# EAGLE design 2x16_2MM breakout front (EAGLE 6.3)
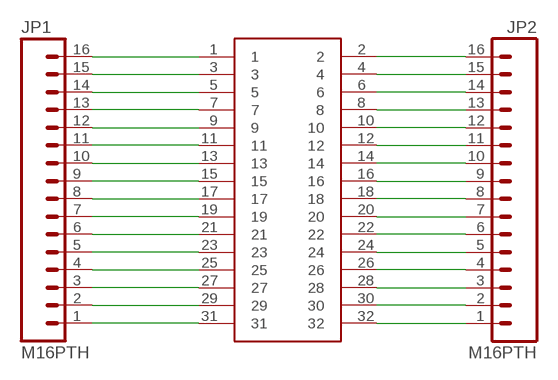
[diagram p0: schematic, sheet 1]

## Parts
JP1  M16PTH  [1X16]
JP2  M16PTH  [1X16]
U$1  2X16_2MM_SMD  [2X16_2MM_SMD]

## Nets
N$1: JP1.16 U$1.1
N$2: JP1.15 U$1.3
N$3: JP1.14 U$1.5
N$4: JP1.13 U$1.7
N$5: JP1.12 U$1.9
N$6: JP1.11 U$1.11
N$7: JP1.10 U$1.13
N$8: JP1.9 U$1.15
N$9: JP1.8 U$1.17
N$10: JP1.7 U$1.19
N$11: JP1.6 U$1.21
N$12: JP1.5 U$1.23
N$13: JP1.4 U$1.25
N$14: JP1.3 U$1.27
N$15: JP1.2 U$1.29
N$16: JP1.1 U$1.31
N$17: JP2.1 U$1.32
N$18: JP2.2 U$1.30
N$19: JP2.3 U$1.28
N$20: JP2.4 U$1.26
N$21: JP2.5 U$1.24
N$22: JP2.6 U$1.22
N$23: JP2.7 U$1.20
N$24: JP2.8 U$1.18
N$25: JP2.9 U$1.16
N$26: JP2.10 U$1.14
N$27: JP2.11 U$1.12
N$28: JP2.12 U$1.10
N$29: JP2.13 U$1.8
N$30: JP2.14 U$1.6
N$31: JP2.15 U$1.4
N$32: JP2.16 U$1.2

## Library data of the parts
JP1 JP2 = SparkFun-Connectors:M16: 1x16 .1" header
U$1 = Strutz Electronic Industries:2X16_2MM_SMD

## Board
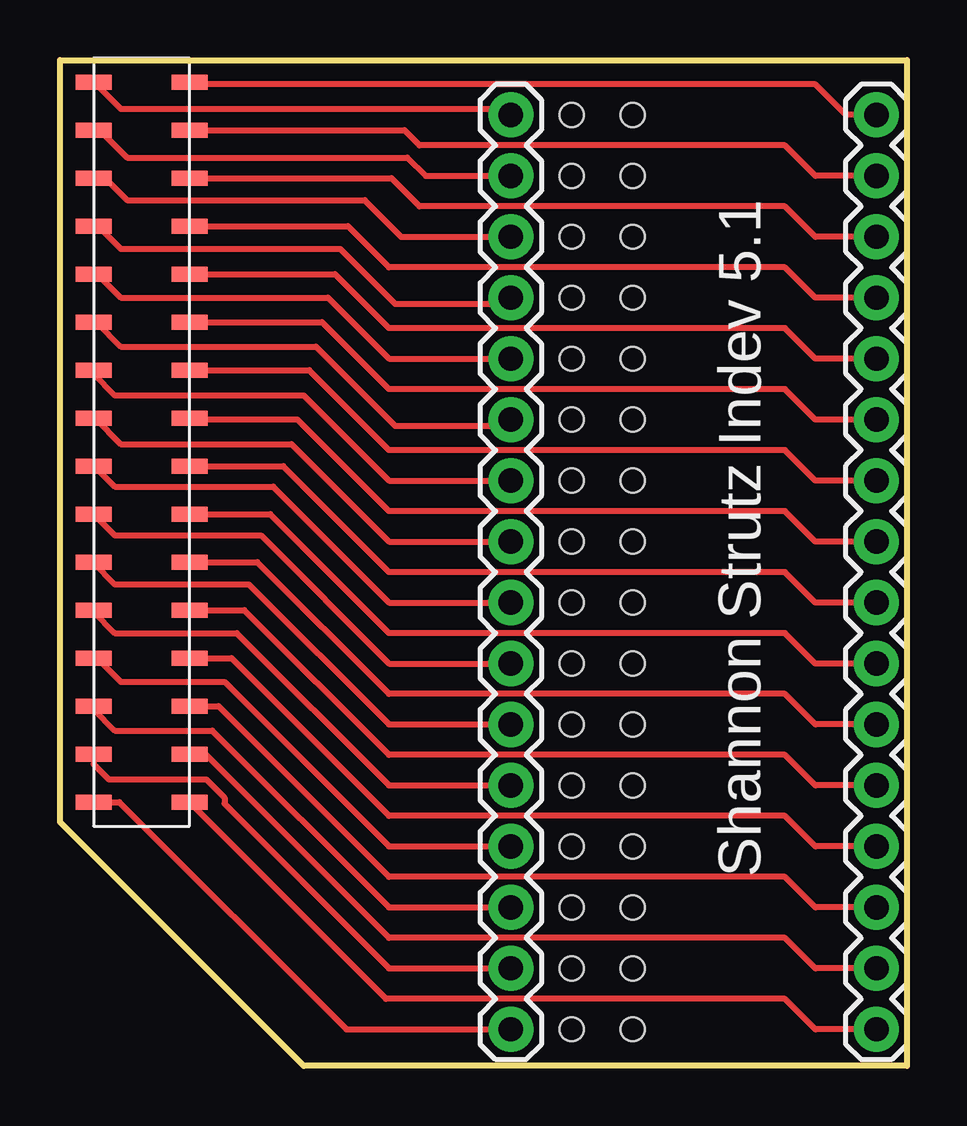
[diagram p1: board, top side]

Size 35.31 x 41.91 mm. Coordinates in mm from the lower left corner, seen from the top.
Outline: 0,41.91 35.31,41.91 35.31,0 10.16,0 0,10.16 0,41.91
Copper layers (1*16): Top 0.035mm / dielectric 1.5mm / Bottom 0.035mm
Design rules "default": minimum track width 10mil, minimum drill 24mil, track to track 8mil, track to pad 8mil, pad to pad 8mil, via to via 8mil, smd to smd 8mil, copper to edge 40mil, drill to drill 8mil, minimum pad ring 10mil, minimum via ring 8mil, stop-mask expansion 4mil, vias tented up to drill 0mil, thermal gap 10mil
Holes 1 mm at 21.34,1.52 23.88,1.52 23.88,4.06 21.34,4.06 21.34,6.6 23.88,6.6 23.88,9.14 21.34,9.14 23.88,11.68 21.34,11.68 21.34,14.22 23.88,14.22 23.88,16.76 21.34,16.76 21.34,19.3 23.88,19.3 23.88,21.84 21.34,21.84 21.34,24.38 23.88,24.38 23.88,26.92 21.34,26.92 21.34,29.46 23.88,29.46 21.34,32 23.88,32 21.34,34.54 23.88,34.54 21.34,37.08 23.88,37.08 23.88,39.62 21.34,39.62

### Footprints (pad centres in the part's own frame; a part is rotated, then mirrored left to right if it is on the bottom)
1X16 = drill 1.016 pad 1.88: 1 0,0; 2 2.54,0; 3 5.08,0; 4 7.62,0; 5 10.16,0; 6 12.7,0; 7 15.24,0; 8 17.78,0; 9 20.32,0; 10 22.86,0; 11 25.4,0; 12 27.94,0; 13 30.48,0; 14 33.02,0; 15 35.56,0; 16 38.1,0
2X16_2MM_SMD = smd 0.635 x 1.5: 1 -15,-2; 2 -15,2; 3 -13,-2; 4 -13,2; 5 -11,-2; 6 -11,2; 7 -9,-2; 8 -9,2; 9 -7,-2; 10 -7,2; 11 -5,-2; 12 -5,2; 13 -3,-2; 14 -3,2; 15 -1,-2; 16 -1,2; 17 1,-2; 18 1,2; 19 3,-2; 20 3,2; 21 5,-2; 22 5,2; 23 7,-2; 24 7,2; 25 9,-2; 26 9,2; 27 11,-2; 28 11,2; 29 13,-2; 30 13,2; 31 15,-2; 32 15,2

### Placement (x,y rotation side)
JP1  34.04,39.62 270 top
JP2  18.8,39.62 270 top
U$1  3.4,25.98 90 top

### Tracks (layer width: path | path; a pad name or v marks a point on that pad's centre or on a via)
N$1
  Top 0.254: JP1.16 31.5,1.52 30.23,2.79 13.59,2.79 U$1.1
N$2
  Top 0.254: JP1.15 31.5,4.06 30.23,5.33 13.72,5.33 6.1,12.95 5.43,12.95 U$1.3
N$3
  Top 0.254: JP1.14 31.5,6.6 30.23,7.87 13.72,7.87 6.61,14.98 U$1.5
N$4
  Top 0.254: JP1.13 31.5,9.14 30.23,10.41 13.72,10.41 7.15,16.98 U$1.7
N$5
  Top 0.254: JP1.12 31.5,11.68 30.23,12.95 13.72,12.95 7.69,18.98 U$1.9
N$6
  Top 0.254: JP1.11 31.5,14.22 30.23,15.49 13.72,15.49 8.23,20.98 U$1.11
N$7
  Top 0.254: JP1.10 31.5,16.76 30.23,18.03 13.72,18.03 8.77,22.98 U$1.13
N$8
  Top 0.254: JP1.9 31.5,19.3 30.23,20.57 13.72,20.57 9.31,24.98 U$1.15
N$9
  Top 0.254: JP1.8 31.5,21.84 30.23,23.11 13.72,23.11 9.91,26.92 5.46,26.92 U$1.17
N$10
  Top 0.254: JP1.7 31.5,24.38 30.23,25.65 13.72,25.65 10.39,28.98 U$1.19
N$11
  Top 0.254: JP1.6 31.5,26.92 30.23,28.19 13.72,28.19 11.81,30.1 11.18,30.73 10.93,30.98 U$1.21
N$12
  Top 0.254: JP1.5 31.5,29.46 30.23,30.73 13.72,30.73 11.47,32.98 U$1.23
N$13
  Top 0.254: JP1.4 31.5,32 30.23,33.27 13.72,33.27 12.01,34.98 U$1.25
N$14
  Top 0.254: JP1.3 31.5,34.54 30.23,35.81 14.99,35.81 13.82,36.98 U$1.27
N$15
  Top 0.254: JP1.2 31.5,37.08 30.23,38.35 14.99,38.35 14.36,38.98 U$1.29
N$16
  Top 0.254: JP1.1 32.77,39.62 31.5,40.89 5.49,40.89 U$1.31
N$17
  Top 0.254: U$1.32 1.43,40.98 2.54,39.88 18.54,39.88 JP2.1
N$18
  Top 0.254: U$1.30 1.66,38.98 2.79,37.85 14.48,37.85 15.24,37.08 JP2.2
N$19
  Top 0.254: U$1.28 1.88,36.98 2.79,36.07 12.7,36.07 14.22,34.54 JP2.3
N$20
  Top 0.254: U$1.26 1.59,34.98 2.54,34.04 11.68,34.04 13.97,31.75 18.54,31.75 JP2.4
N$21
  Top 0.254: U$1.24 1.56,32.98 2.54,32 11.18,32 13.72,29.46 JP2.5
N$22
  Top 0.254: U$1.22 1.53,30.98 2.54,29.97 10.67,29.97 13.97,26.67 18.54,26.67 JP2.6
N$23
  Top 0.254: U$1.20 1.4,28.83 2.29,27.94 10.16,27.94 13.72,24.38 JP2.7
N$24
  Top 0.254: U$1.18 1.46,26.98 2.54,25.91 9.65,25.91 13.72,21.84 JP2.8
N$25
  Top 0.254: U$1.16 1.43,24.98 2.29,24.13 8.89,24.13 13.72,19.3 JP2.9
N$26
  Top 0.254: U$1.14 2.29,22.1 8.38,22.1 13.72,16.76 JP2.10
N$27
  Top 0.254: U$1.12 1.4,20.96 2.29,20.07 7.87,20.07 13.72,14.22 JP2.11
N$28
  Top 0.254: U$1.10 1.4,18.92 2.29,18.03 7.37,18.03 13.72,11.68 JP2.12
N$29
  Top 0.254: U$1.8 1.56,16.98 2.54,16 6.86,16 13.72,9.14 JP2.13
N$30
  Top 0.254: U$1.6 1.4,14.86 2.29,13.97 6.35,13.97 13.72,6.6 JP2.14
N$31
  Top 0.254: U$1.4 1.4,12.57 2.03,11.94 6.1,11.94 6.86,11.18 6.86,10.92 13.72,4.06 JP2.15
N$32
  Top 0.254: U$1.2 2.48,10.98 11.94,1.52 JP2.16

### Text on the board
tSilk: Shannon Strutz Indev 5.1